# EAGLE schematic 5_way_switch_schematic (EAGLE 6.5.0)
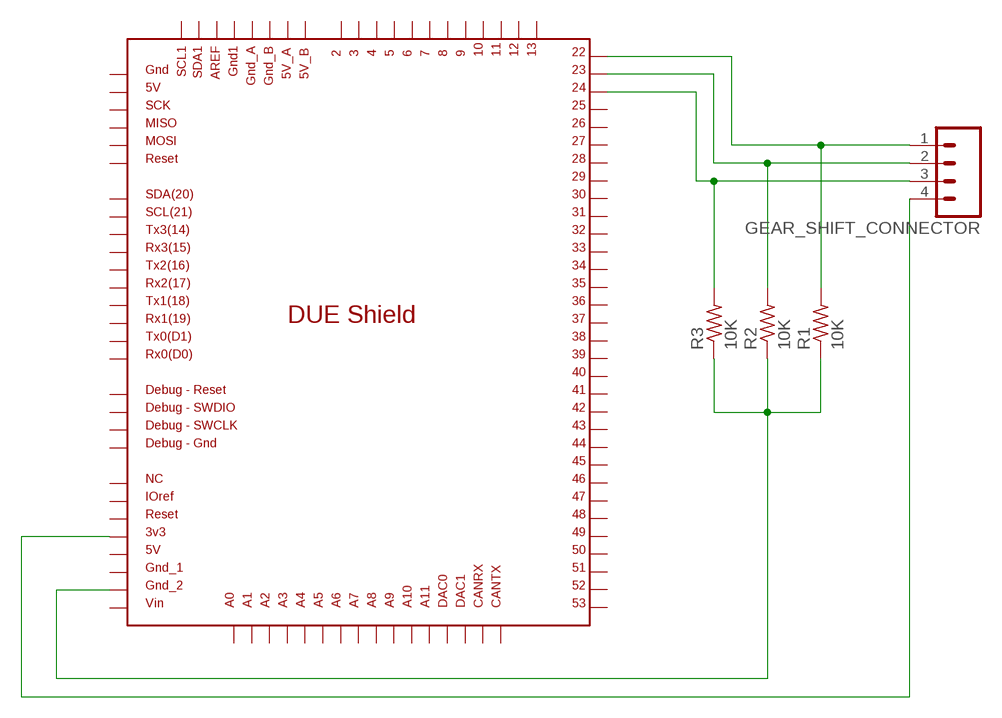
[diagram p0: schematic, sheet 1]

## Parts
GEAR_SHIFT_CONNECTOR  M04JST-PTH-VERT  [JST-4-PTH-VERT]
R1  10K  R-US_0204/5  [0204/5]
R2  10K  R-US_0204/5  [0204/5]
R3  10K  R-US_0204/5  [0204/5]
U$1  DUE(NORMAL)  [DUE(NORMAL)]

## Nets
N$1: GEAR_SHIFT_CONNECTOR.4 U$1.3V3
N$2: GEAR_SHIFT_CONNECTOR.1 R1.2 U$1.22
N$3: GEAR_SHIFT_CONNECTOR.2 R2.2 U$1.23
N$4: GEAR_SHIFT_CONNECTOR.3 R3.2 U$1.24
N$5: R1.1 R2.1 R3.1 U$1.GND_2
Unconnected: U$1.2 U$1.3 U$1.4 U$1.5 U$1.5V U$1.5V_A U$1.5V_B U$1.5V_ICSP U$1.6 U$1.7 U$1.8 U$1.9 U$1.10 U$1.11 U$1.12 U$1.13 U$1.25 U$1.26 U$1.27 U$1.28 U$1.29 U$1.30 U$1.31 U$1.32 U$1.33 U$1.34 U$1.35 U$1.36 U$1.37 U$1.38 U$1.39 U$1.40 U$1.41 U$1.42 U$1.43 U$1.44 U$1.45 U$1.46 U$1.47 U$1.48 U$1.49 U$1.50 U$1.51 U$1.52 U$1.53 U$1.A0 U$1.A1 U$1.A2 U$1.A3 U$1.A4 U$1.A5 U$1.A6 U$1.A7 U$1.A8 U$1.A9 U$1.A10 U$1.A11 U$1.AREF U$1.CANRX U$1.CANTX U$1.DAC0 U$1.DAC1 U$1.GND1 U$1.GND_1 U$1.GND_A U$1.GND_B U$1.GND_DEBUG U$1.GND_ICSP U$1.IOREF U$1.MISO_ICSP U$1.MOSI_ICSP U$1.NC U$1.RESET U$1.RESET_DEBUG U$1.RESET_ICSP U$1.RX0 U$1.RX1 U$1.RX2 U$1.RX3 U$1.SCK_ICSP U$1.SCL U$1.SCL1 U$1.SDA U$1.SDA1 U$1.SWCLK_DEBUG U$1.SWDIO_DEBUG U$1.TX0 U$1.TX1 U$1.TX2 U$1.TX3 U$1.VIN

## Library data of the parts
GEAR_SHIFT_CONNECTOR = SparkFun-Connectors:M04: Header 4 Standard 4-pin 0.1" header. Use with straight break away headers (SKU : PRT-00116), right angle break away headers (PRT-00553), swiss pins (PRT-00743), machine pins (PRT-00117), and female headers (PRT-00115). Molex polarized connector foot print use with SKU : PRT-08231 with associated crimp pins and housings. 1MM SMD Version SKU: PRT-10208
R1-R3 = adafruit:R-US_: RESISTOR, American symbol
U$1 = DUElib130425:DUE(NORMAL)